# Altium schematic sheet LEDcontroller.SchDoc
size A4; SheetNumber: 1; SheetTotal: 5
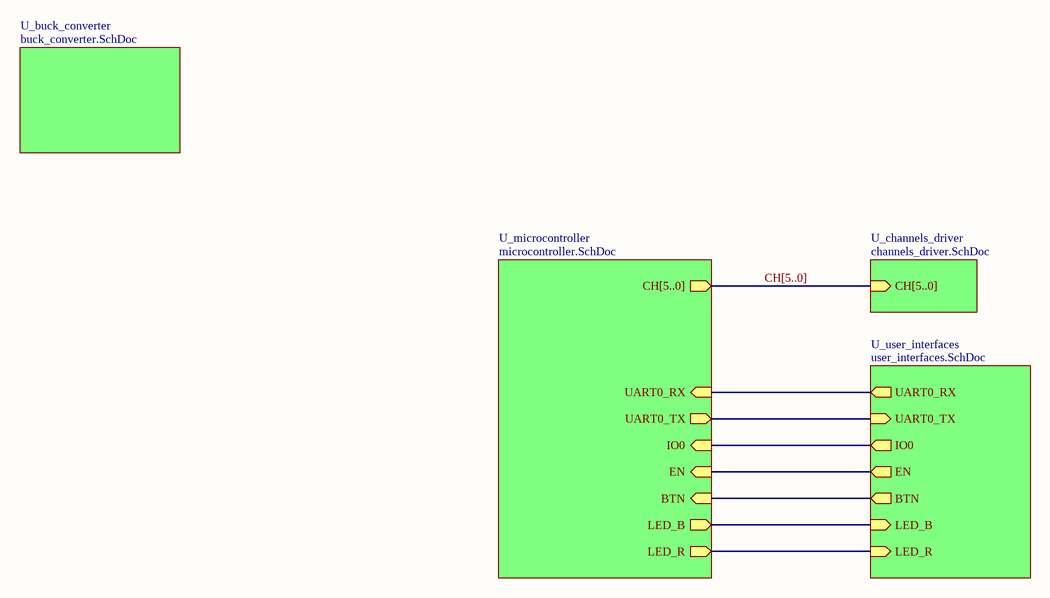
[diagram p0: LEDcontroller.SchDoc]

## Sub-sheets
U_buck_converter = buck_converter.SchDoc: no entries
U_channels_driver = channels_driver.SchDoc: CH[5..0] (in)
U_microcontroller = microcontroller.SchDoc: CH[5..0] (out), UART0_TX (out), UART0_RX (in), IO0 (in), BTN (in), LED_R (out), LED_B (out), EN (in)
U_user_interfaces = user_interfaces.SchDoc: UART0_TX (in), UART0_RX (out), IO0 (out), EN (out), BTN (out), LED_R (in), LED_B (in)

## Nets
(unnamed): sheet U_microcontroller/UART0_TX, sheet U_user_interfaces/UART0_TX
(unnamed): sheet U_microcontroller/UART0_RX, sheet U_user_interfaces/UART0_RX
(unnamed): sheet U_microcontroller/IO0, sheet U_user_interfaces/IO0
(unnamed): sheet U_microcontroller/BTN, sheet U_user_interfaces/BTN
(unnamed): sheet U_microcontroller/LED_R, sheet U_user_interfaces/LED_R
(unnamed): sheet U_microcontroller/LED_B, sheet U_user_interfaces/LED_B
(unnamed): sheet U_microcontroller/EN, sheet U_user_interfaces/EN

## Buses and harness runs
bus CH[5..0] = sheet U_channels_driver/CH[5..0] = sheet U_microcontroller/CH[5..0]